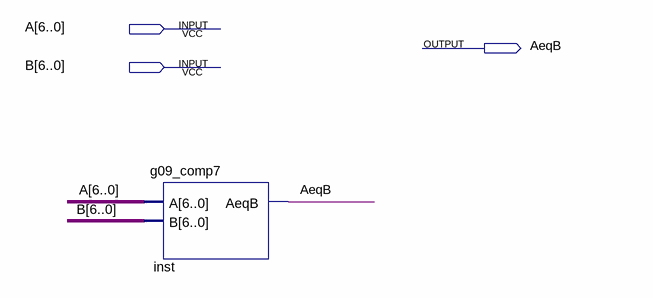
[diagram p0: schematic sheet]
// Quartus schematic g09_lab1.bdf as structural Verilog: 1 symbols, 3 pins
module g09_lab1 (
  input  [6:0] A,
  input  [6:0] B,
  output AeqB
);

  g09_comp7 inst (.A(A), .B(B), .AeqB(AeqB));
endmodule
